# Altium schematic sheet SCH_09_InOut_Terminal.SchDoc
size A4; SheetNumber: 14; SheetTotal: 14
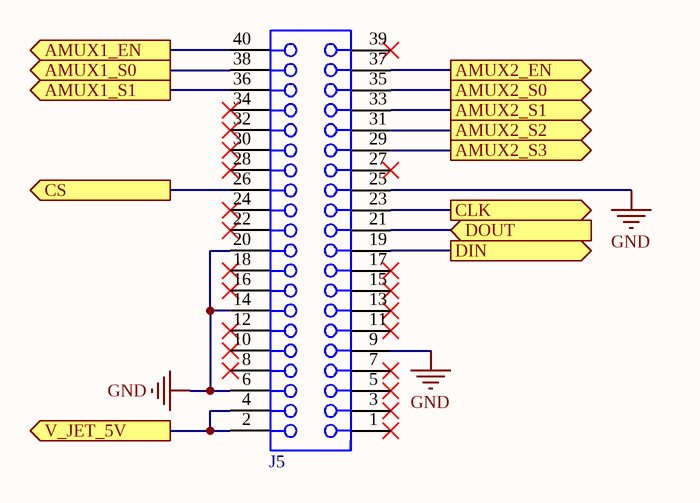
[diagram p0: SCH_09_InOut_Terminal.SchDoc]

## Parts
J5  613040243121  [613040243121]  (value not drawn)

## Ports
AMUX1_EN (out, see Schematic_Top[4B], SCH_06_Analog_Mux[1A]), AMUX1_S0 (out, see Schematic_Top[4B], SCH_06_Analog_Mux[1B]), AMUX1_S1 (out, see Schematic_Top[4B], SCH_06_Analog_Mux[1B]), AMUX2_EN (out, see Schematic_Top[4B], SCH_06_Analog_Mux[1B]), AMUX2_S0 (out, see Schematic_Top[4B], SCH_06_Analog_Mux[1C]), AMUX2_S1 (out, see Schematic_Top[4B], SCH_06_Analog_Mux[1C]), AMUX2_S2 (out, see Schematic_Top[4B], SCH_06_Analog_Mux[1D]), AMUX2_S3 (out, see Schematic_Top[4C], SCH_06_Analog_Mux[1D]), CLK (out, see Schematic_Top[4B], SCH_08_ADC[3C]), CS (out, see Schematic_Top[4A], SCH_08_ADC[3B]), DIN (out, see Schematic_Top[4B], SCH_08_ADC[3C]), DOUT (in, see Schematic_Top[4B], SCH_08_ADC[3C]), V_JET_5V (out, see Schematic_Top[4C], SCH_01_Power[1A])

## Nets
GND: J5.6 J5.9 J5.14 J5.20 J5.25
AMUX1_EN: J5.40 ; port AMUX1_EN
AMUX1_S0: J5.38 ; port AMUX1_S0
AMUX1_S1: J5.36 ; port AMUX1_S1
AMUX2_EN: J5.37 ; port AMUX2_EN
AMUX2_S0: J5.35 ; port AMUX2_S0
AMUX2_S1: J5.33 ; port AMUX2_S1
AMUX2_S2: J5.31 ; port AMUX2_S2
AMUX2_S3: J5.29 ; port AMUX2_S3
CLK: J5.23 ; port CLK
CS: J5.26 ; port CS
DIN: J5.19 ; port DIN
DOUT: J5.21 ; port DOUT
V_JET_5V: J5.2 J5.4 ; port V_JET_5V

Not connected (* = marked no-connect by the designer): J5 1* 3* 5* 7* 8* 10* 11* 12* 13* 15* 16* 17* 18* 22* 24* 27* 28* 30* 32* 34* 39*

## Notes on the sheet
- Title:
- Date:
- Time:
- Drawn by:
- Phung Nhat Minh
- Sheet
- of

## Library data of the parts
J5 = 613040243121: WR-PHD Socket Header, THT, Angled, pitch 2.54mm, 2 Row, 40P; Manufacturer: Wurth Elektronik; Contact Resistance: 20mOhm; Rated Current: 3A; Working Voltage: 250V; Withstanding Voltage: 500V; Manufacturer Part Number: 613040243121; Category: Board-to-Board Connectors; Match Code: WR-PHD; ComponentLink1Description: Website Link; ComponentLink1URL: https://www.we-online.com/redexpert/article/613040243121?ad; ComponentLink2Description: Datasheet Link; ComponentLink2URL: https://www.we-online.com/redexpert/spec/613040243121?ad; Mount: Through Hole; Operating Temperature Max: 125°C; Operating Temperature Min: -40°C; Packaging: Tray; Gender: Socket Header; Number of Pins: 40; Number of Rows: 2; Orientation: Angled; Pitch: 2.54mm